# EAGLE design comeNCap (EAGLE 9.6.2)
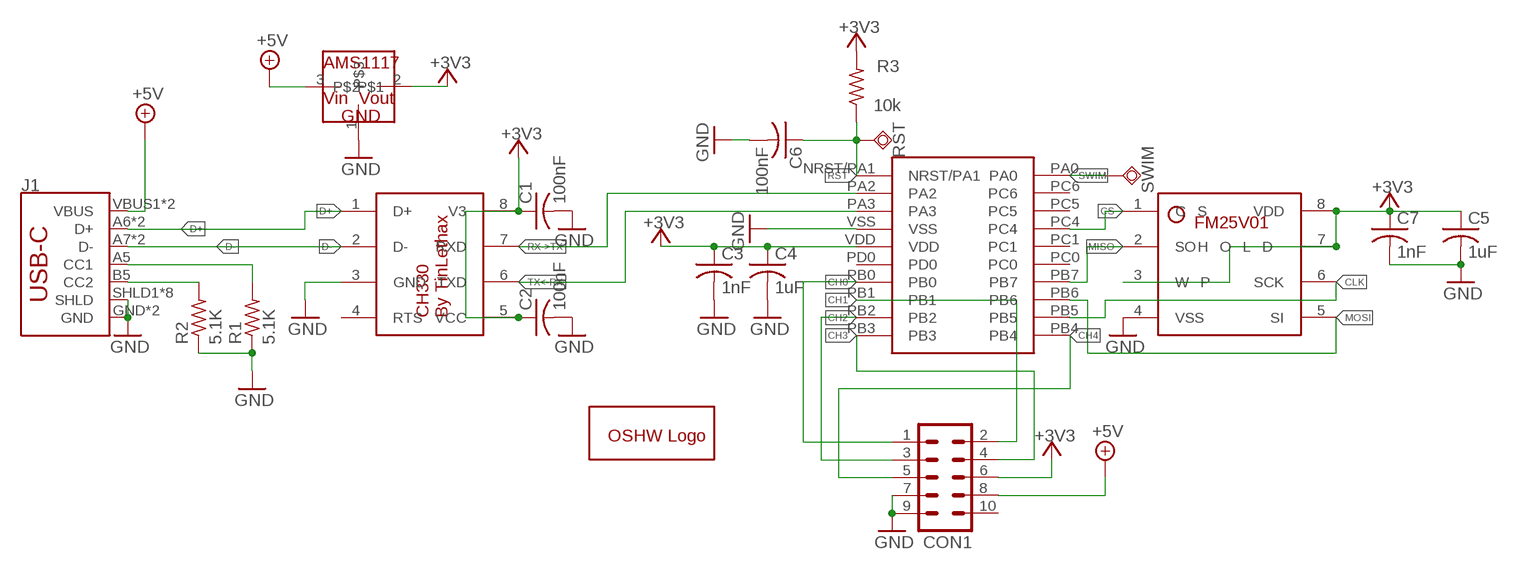
[diagram p0: schematic, sheet 1]

## Parts
C1  100nF  C-USC1210  [C1210]
C2  100nF  C-USC1210  [C1210]
C3  1nF  C-USC0805  [C0805]
C4  1uF  C-USC0603  [C0603]
C5  1uF  C-USC0603  [C0603]
C6  100nF  C-USC1210  [C1210]
C7  1nF  C-USC0805  [C0805]
CON1  MA05-2  [MA05-2]
GOLD_ORB_SM1  OSHWLOGOLOGO5MM  [OSHW_5MM]
J1  USB_C16PIN  [USB-C-16P]
R1  5.1K  R-US_R0805  [R0805]
R2  5.1K  R-US_R0805  [R0805]
R3  10k  R-US_R0805  [R0805]
RST  TPSQTP20R  [TP20R]
SWIM  TPSQTP20R  [TP20R]
U$1  STM8L151F3  [UFQFPN-20]
U$2  FM25V01  [SOIC127P601X172-8N]
U$3  CH330  [SOIC127P600X150-8N]
U$4  AMS1117  [SOT223]

## Nets
+3V3: C1.1 C2.1 C3.1 C4.1 C5.1 C7.1 CON1.6 R3.2 U$1.VDD U$2.3(W̅P̅) U$2.7(H̅O̅L̅D̅) U$2.8(VDD) U$3.5(VCC) U$3.8(V3) U$4.2
+5V: CON1.8 J1.VBUS1(VBUS) J1.VBUS2(VBUS) U$4.3
CH0: CON1.1 U$1.PB0
CH1: CON1.2 U$1.PB1
CH2: CON1.3 U$1.PB2
CH3: CON1.4 U$1.PB3
CH4: CON1.5 U$1.PB4
CLK: U$1.PB5 U$2.6(SCK)
CS: U$1.PC4 U$2.1(C̅S̅)
D+: J1.A6(D+) J1.B6(D+) U$3.1(D+)
D-: J1.A7(D-) J1.B7(D-) U$3.2(D-)
GND: C1.2 C2.2 C3.2 C4.2 C5.2 C6.2 C7.2 CON1.7 CON1.9 J1.GND J1.GND2(GND) J1.SHLD1(SHLD) J1.SHLD2(SHLD) J1.SHLD3(SHLD) J1.SHLD4(SHLD) J1.SHLD5(SHLD) J1.SHLD6(SHLD) J1.SHLD7(SHLD) J1.SHLD8(SHLD) R1.1 R2.1 U$1.VSS U$2.4(VSS) U$3.3(GND) U$4.1
MISO: U$1.PB7 U$2.2(SO)
MOSI: U$1.PB6 U$2.5(SI)
N$6: J1.A5(CC1) R1.2
N$7: J1.B5(CC2) R2.2
RST: C6.1 R3.1 RST.TP U$1.NRST/PA1
RX->TX: U$1.PA2 U$3.7(RXD)
SWIM: SWIM.TP U$1.PA0
TX<-RX: U$1.PA3 U$3.6(TXD)
Unconnected: CON1.10 U$1.PC0 U$1.PC1 U$1.PC5 U$1.PC6 U$1.PD0 U$3.4(RTS)

## Library data of the parts
C1-C7 = capsmd:C-US: CAPACITOR, American symbol; SPICEPREFIX: C
CON1 = con-lstb:MA05-2: PIN HEADER; OC_FARNELL: unknown; OC_NEWARK: unknown
GOLD_ORB_SM1 = oshw:OSHWLOGO: The OSHW logo for PCB layout
J1 = SparkFun-Connectors:USB_C: USB Type C 16Pin Connector Super Speed pins not available on the 16-pin purely SMD connector so this part is best for USB 2.0 implementations. D1 and D2 are tied together enabling D+/- no matter which way the cable is plugged into the connector. The two channel configuration pins (CC1/2) are exposed. These are normally connected to ground via 5.1k resistors but can be reconfigured for high current/high power applications.; PROD_ID: CONN-14122
R1-R3 = rcl:R-US_: RESISTOR, American symbol; SPICEPREFIX: R
RST SWIM = testpad:TPSQ: Test pad
U$1 = STM8L151F3:STM8L151F3: STM8L151F3 8bit mcuwith the 3x3 mm size !
U$2 = FM25V01:FM25V01: The FM25V01A is a 128-Kbit nonvolatile memory employing an advanced ferroelectric process. An F-RAM is nonvolatile and performs reads and writes similar to a RAM. It provides reliable data retention for 151 years while eliminating the complexities, overhead, and system-level reliability problems caused by serial flash, EEPROM, and other nonvolatile memories. Unlike serial flash and EEPROM, the FM25V01A performs write operations at bus speed. No write delays are incurred. Data is written to the memory array immediately after each byte is successfully transferred to the device. The next bus cycle can commence without the need for data polling. In addition, the product offers substantial write endurance compared with other nonvolatile memories. The FM25V01A is capable of supporting 1014 read/write cycles, or 100 million times more write cycles than EEPROM.; PARTNO: FM52V01
U$3 = CH330:CH330: CH330 Super small Serial to USB chip; DESCRIPTION: CH330 Super small Serial to USB chip; PACKAGE: SOP8; PARTNO: CH330
U$4 = AMS1117:AMS1117: The The AMS1117 series of adjustable and fixed voltage regulators are designed to provide up to1A output current and to operate down to 1V input-to-output differential. The dropout voltage of the device is guaranteed maximum 1.3V, decreasing at lower load currents.; PARTNO: AMS1117

## Board
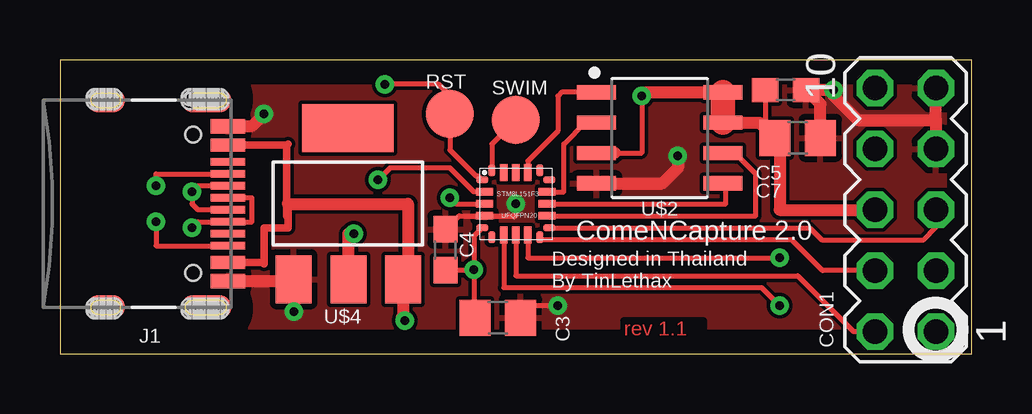
[diagram p1: board, top side]
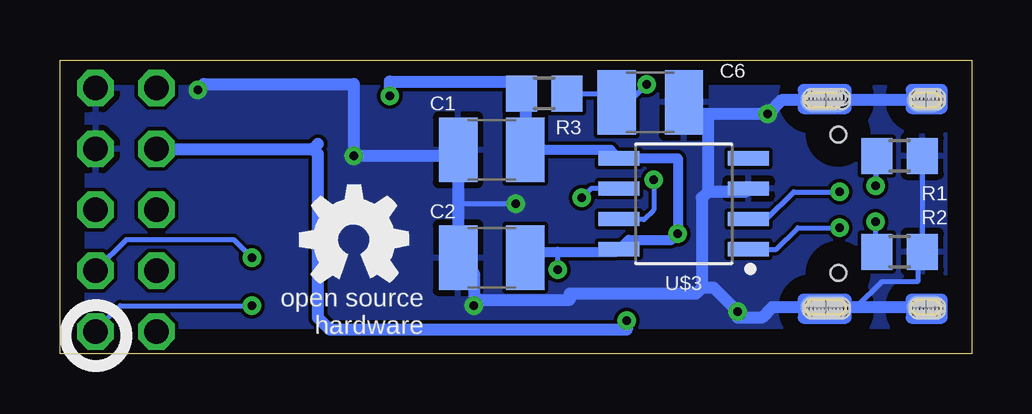
[diagram p2: board, bottom side, seen from below]

Size 38 x 12.25 mm. Coordinates in mm from the lower left corner, seen from the top.
Outline: 0,0 38,0 38,12.25 0,12.25 0,0
Copper layers (1*16): Top 0.035mm / dielectric 1.5mm / Bottom 0.035mm
Design rules "default": minimum track width 6mil, minimum drill 0.35mm, track to track 6mil, track to pad 6mil, pad to pad 6mil, via to via 6mil, smd to smd 6mil, copper to edge 40mil, drill to drill 6mil, minimum pad ring 10mil, minimum via ring 8mil, stop-mask expansion 4mil, vias tented up to drill 0mil, thermal gap 10mil

### Footprints (pad centres in the part's own frame; a part is rotated, then mirrored left to right if it is on the bottom)
C1210 = smd 1.6 x 2.7: 1 -1.4,0; 2 1.4,0
C0805 = smd 1.3 x 1.5: 1 -0.95,0; 2 0.95,0
C0603 = smd 1.1 x 1: 1 -0.85,0; 2 0.85,0
MA05-2 = drill 1.016 octagon: 1 -5.08,-1.27; 2 -5.08,1.27; 3 -2.54,-1.27; 4 -2.54,1.27; 5 0,-1.27; 6 0,1.27; 7 2.54,-1.27; 8 2.54,1.27; 9 5.08,-1.27; 10 5.08,1.27
USB-C-16P = smd 0.3 x 1.45: A5 -1.25,0; A6 -0.25,0; A7 0.25,0; A8 1.25,0; B5 1.75,0; B6 0.75,0; B7 -0.75,0; B8 -1.75,0 | smd 0.6 x 1.45: GND -3.225,0; GND2 3.225,0 | smd 1 x 2.1: SHLD1 -4.32,-0.915; SHLD2 4.32,-0.915 | smd 1 x 2.1 bottom: SHLD3 -4.32,-0.915; SHLD4 4.32,-0.915 | smd 1 x 1.6: SHLD5 -4.32,-5.095; SHLD8 4.32,-5.095 | smd 1 x 1.6 bottom: SHLD6 -4.32,-5.095; SHLD7 4.32,-5.095 | smd 0.55 x 1.45: VBUS1 -2.45,0; VBUS2 2.45,0 | hole 0.65: -2.89,-1.445; 2.89,-1.445; -4.445,-0.318; -4.286,-0.318; -4.445,-0.476; -4.286,-0.476; -4.445,-0.635; -4.286,-0.635; -4.445,-0.794; -4.286,-0.794; -4.445,-0.953; -4.286,-0.953; -4.445,-1.111; -4.286,-1.111; -4.445,-1.27; -4.286,-1.27; -4.445,-1.429; -4.445,-1.587; -4.286,-1.587; 4.445,-0.318; 4.286,-0.318; 4.445,-0.476; 4.286,-0.476; 4.445,-0.635; 4.286,-0.635; 4.445,-0.794; 4.286,-0.794; 4.445,-0.953; 4.286,-0.953; 4.445,-1.111; 4.286,-1.111; 4.445,-1.27; 4.286,-1.27; 4.445,-1.429; 4.286,-1.429; 4.445,-1.587; 4.286,-1.587; 4.445,-4.763; 4.286,-4.763; 4.445,-4.921; 4.286,-4.921; 4.445,-5.08; 4.286,-5.08; 4.445,-5.239; 4.286,-5.239; 4.445,-5.397; 4.286,-5.397; 4.445,-5.556; 4.286,-5.556; -4.445,-4.763; -4.286,-4.763; -4.445,-4.921; -4.286,-4.921; -4.445,-5.08; -4.286,-5.08; -4.445,-5.239; -4.286,-5.239; -4.445,-5.397; -4.286,-5.397; -4.445,-5.556; -4.286,-5.556
R0805 = smd 1.3 x 1.5: 1 -0.95,0; 2 0.95,0
TP20R = smd 2 x 2: TP 0,0
UFQFPN-20 = smd 0.5 x 0.3: NRST/PA1 -1.4,1; PB4 1.4,-1; PC0 1.4,1; VDD -1.4,-1 | smd 0.3 x 0.5: PA0 -1,1.4; PB3 1,-1.4; PC1 1,1.4; PD0 -1,-1.4 | smd 0.7 x 0.3: PA2 -1.3,0.5; PA3 -1.3,0; PB5 1.3,-0.5; PB6 1.3,0; PB7 1.3,0.5; VSS -1.3,-0.5 | smd 0.3 x 0.7: PB0 -0.5,-1.3; PB1 0,-1.3; PB2 0.5,-1.3; PC4 0.5,1.3; PC5 0,1.3; PC6 -0.5,1.3
SOIC127P601X172-8N = smd 1.641 x 0.602: 1 -2.637,1.905; 2 -2.637,0.635; 3 -2.637,-0.635; 4 -2.637,-1.905; 5 2.637,-1.905; 6 2.637,-0.635; 7 2.637,0.635; 8 2.637,1.905
SOIC127P600X150-8N = smd 1.708 x 0.602: 1 -2.7,1.905; 2 -2.7,0.635; 3 -2.7,-0.635; 4 -2.7,-1.905; 5 2.7,-1.905; 6 2.7,-0.635; 7 2.7,0.635; 8 2.7,1.905
SOT223 = smd 1.499 x 2.007: 1 -2.261,-3.15; 2 0.025,-3.15; 3 2.311,-3.15 | smd 3.81 x 2.007: 4 0,3.15

### Placement (x,y rotation side)
C1  20,8.5 180 bottom
C2  20,4 180 bottom
C3  18.25,1.5 0 top
C4  16.07,4.33 90 top
C5  30.25,11 0 top
C6  13.39,10.48 0 bottom
C7  30.75,9 0 top
CON1  35.25,6 90 top
GOLD_ORB_SM1  25.75,4.75 0 bottom
J1  7,6.25 270 top
R1  3,8.25 180 bottom
R2  3,4.25 180 bottom
R3  17.81,10.85 180 bottom
RST  16.25,10 0 top
SWIM  19,9.75 0 top
U$1  19,6.25 0 top
U$2  25,9 0 top
U$3  12,6.25 180 bottom
U$4  12,6.25 0 top

### Tracks (layer width: path | path; a pad name or v marks a point on that pad's centre or on a via)
+3V3  (via drill 0.35)
  Top 0.2: U$1.VDD 17.25,4.9 v17.25,3.5 | C4.1 16.09,3.5 v17.25,3.5 | v17.25,3.5 17.25,1.55 C3.1 | U$2.7 27.64,9.5 29.3,9.5 C7.1 29.4,9.4 C5.1 | U$2.3 24.25,8.37 v24.25,10.75
  Top 0.508: U$4.2 12.03,5 v12.25,5 | v24.25,10.75 24.25,10.9 U$2.8 | 23.14,8.37 U$2.3 | CON1.6 30,6 30,8.8 C7.1 29.16,9.63 U$2.7
  Top 1.016: U$2.8 U$2.7
  Bottom 0.2: v17.25,3.5 17.25,4.25 | v12.25,5 12.5,4.75
  Bottom 0.406: C2.1 18.35,4.25 17.25,4.25 14.79,4.25 U$3.8 14.29,4.75 12.5,4.75 | C1.1 15.04,8.5 U$3.5 12.25,8.16 v12.25,5
  Bottom 0.508: C1.1 18.6,10.69 R3.2 19.26,11.35 24.25,11.35 v24.25,10.75
+5V  (via drill 0.35)
  Top 0.305: J1.VBUS1 9.45,8.7 | 9.5,8.75 9.45,8.7 | 9.45,8.7 9.45,5.75 9.5,5.75 | J1.VBUS2 8.5,3.8 | 8.5,3.8 8.5,3.75 | 8.5,3.8 8.5,5.25 9.5,5.25 9.5,5.75 | 9.5,5.75 9.5,6.25
  Top 0.508: 9.5,6.25 14.5,6.25 14.5,3.29 U$4.3 14.31,1.56 14.25,1.5 v14.38,1.38
  Bottom 0.508: CON1.8 27.46,8.54 | 27.46,8.54 27.25,8.75 | 27.46,8.54 27.25,8.33 27.25,1.5 26.75,1 14.38,1 v14.38,1.38
CH0  (via drill 0.35)
  Top 0.2: U$1.PB0 18.5,2.75 29.25,2.75 v30,2
  Bottom 0.2: v30,2 35.5,2 36.52,0.98 CON1.1
CH1
  Top 0.2: CON1.2 33.08,0.92 30.75,3.25 19,3.25 U$1.PB1
CH2  (via drill 0.35)
  Top 0.2: U$1.PB2 19.5,4 v30,4
  Bottom 0.2: v30,4 30.75,4.75 35.25,4.75 36.52,3.48 CON1.3
CH3
  Top 0.2: CON1.4 31.79,3.46 30.5,4.75 20.1,4.75 U$1.PB3
CH4
  Top 0.2: U$1.PB4 31.25,5.25 31.75,4.75 36,4.75 36.52,5.27 CON1.5
CLK
  Top 0.2: U$1.PB5 29,5.75 29,7.5 28.14,8.37 U$2.6
CS
  Top 0.2: U$1.PC4 19.5,8.04 20.75,9.29 20.75,10.75 20.91,10.9 U$2.1
D+  (via drill 0.35)
  Top 0.2: J1.A6 8,6.5 8,5.5 J1.B6 5.75,5.5 v5.5,5.25
  Bottom 0.2: U$3.1 8.15,4.34 7.25,5.25 v5.5,5.25
D-  (via drill 0.35)
  Top 0.2: J1.B7 5.75,7 v5.5,6.75 5.5,6.25 5.75,6 J1.A7
  Bottom 0.2: U$3.2 8.55,5.62 7.42,6.75 v5.5,6.75
GND  (via drill 0.35)
  Top 0.2: v19,6.25 19,5.75 U$1.VSS 16.64,5.75 C4.2 | v20.75,2 19.7,2 C3.2
  Top 0.508: J1.GND2 9.74,3.02 U$4.1 v9.75,1.75 | J1.GND 7.03,9.5 8,9.5 v8.5,10 | C7.2 31.7,10.4 C5.2 v32.25,11 32.25,10.75 33.25,9.75 36.5,9.75 | U$2.4 25.11,7.09 25.75,7.73 v25.75,8.25 | 36.5,9.75 36.52,9.77 CON1.9 | 36.5,9.75 36.52,9.73 CON1.7
  Bottom 0.2: v19,6.25 21.4,6.25 | R1.1 R2.1 2.25,4.05 2.25,3 3.75,3 4.82,1.93 J1.SHLD4 | 9.75,1.5 v9.75,1.75
  Bottom 0.508: C1.2 21.4,8.25 | 21.4,8.25 21.4,6.25 C2.2 20.75,3.35 v20.75,2 20.5,2.25 16.75,2.25 16.75,2.5 11.5,2.5 11.25,2.75 | 11,10 v8.5,10 7.93,10.57 J1.SHLD3 J1.SHLD6 | 11,10 11,6.75 | 11,6.75 9.44,6.75 U$3.3 | 11,10 11.51,10 C6.2 | 21.4,8.25 v25.75,8.25 25.75,11.25 32,11.25 v32.25,11 | 11,6.75 11.25,6.5 11.25,2.75 | v9.75,1.75 10.75,2.75 11.25,2.75 | J1.SHLD8 J1.SHLD4 8.32,1.93 8.75,1.5 9.75,1.5
  pour Top: 0,12.25 0,0 38,0 38,12 37.75,12.25 0.25,12.25
  pour Bottom: 0,12.25 38,12.25 38,0 0,0
MISO
  Top 0.2: U$1.PB7 21,6.75 21,8.75 21.89,9.63 U$2.2
MOSI
  Top 0.2: U$1.PB6 27.75,6.25 27.75,6.98 U$2.5
N$6  (via drill 0.35)
  Top 0.2: v4,7 4,7.5 J1.A5
  Bottom 0.2: R1.2 4,8.2 v4,7
N$7  (via drill 0.35)
  Top 0.2: J1.B5 4,4.5 v4,5.5
  Bottom 0.2: R2.2 4,4.3 v4,5.5
N$18
  Bottom 0.508: 1.25,11 2.5,11 2.5,10.25 1.25,10.25 1.25,11
N$19
  Bottom 0.508: 5.25,11 7,11 7,10.25 5.25,10.25 5.25,11
N$20
  Bottom 0.508: 5.25,2.25 7,2.25 7,1.5 5.25,1.5 5.25,2.25
N$21
  Bottom 0.508: 1.25,2.25 2.5,2.25 2.5,1.5 1.25,1.5 1.25,2.25
RST  (via drill 0.35)
  Top 0.2: U$1.NRST/PA1 17.45,7.4 17.35,7.4 16.25,8.5 RST.TP 16.25,10.77 15.79,11.23 v13.54,11.23
  Bottom 0.2: R3.1 15.16,10.85 C6.1 14.29,10.48 v13.54,11.23
RX->TX  (via drill 0.35)
  Top 0.2: U$1.PA2 17.25,6.75 16.25,7.75 13.75,7.75 v13.25,7.25
  Bottom 0.2: v13.25,7.25 13.25,6 13.63,5.62 | U$3.7 13.63,5.62 | 13.63,5.62 13.67,5.58
SWIM
  Top 0.2: SWIM.TP 18,8.75 U$1.PA0
TX<-RX  (via drill 0.35)
  Top 0.2: v16.25,6.5 16.5,6.25 U$1.PA3
  Bottom 0.2: U$3.6 15.87,6.88 v16.25,6.5

### Text on the board
Top: rev 1.1
tNames: ComeNCapture 2.0 | Designed in Thailand / By TinLethax